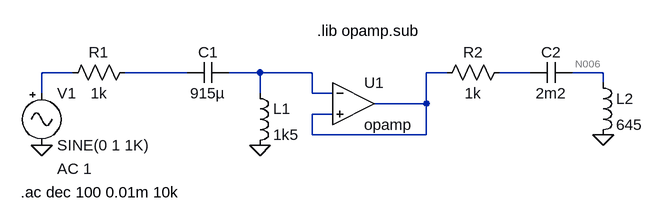
[diagram p0: schematic Draft1.asc]
Draft1.asc, the LTspice schematic file:
Version 4
SHEET 1 996 680
WIRE -80 128 -128 128
WIRE 96 128 0 128
WIRE 208 128 160 128
WIRE 288 128 208 128
WIRE 496 128 464 128
WIRE 624 128 576 128
WIRE 736 128 688 128
WIRE 736 144 736 128
WIRE -128 160 -128 128
WIRE 208 160 208 128
WIRE 288 160 288 128
WIRE 320 160 288 160
WIRE 464 176 464 128
WIRE 464 176 384 176
WIRE 320 192 288 192
WIRE 288 224 288 192
WIRE 464 224 464 176
WIRE 464 224 288 224
FLAG 208 240 0
FLAG 736 224 0
FLAG -128 240 0
SYMBOL res 16 112 R90
WINDOW 0 0 56 VBottom 2
WINDOW 3 32 56 VTop 2
SYMATTR InstName R1
SYMATTR Value 1k
SYMBOL res 592 112 R90
WINDOW 0 0 56 VBottom 2
WINDOW 3 32 56 VTop 2
SYMATTR InstName R2
SYMATTR Value 1k
SYMBOL cap 160 112 R90
WINDOW 0 0 32 VBottom 2
WINDOW 3 32 32 VTop 2
SYMATTR InstName C1
SYMATTR Value 915µ
SYMBOL ind 192 144 R0
SYMATTR InstName L1
SYMATTR Value 1k5
SYMBOL OpAmps\\opamp 352 112 R0
SYMATTR InstName U1
SYMBOL cap 688 112 R90
WINDOW 0 0 32 VBottom 2
WINDOW 3 32 32 VTop 2
SYMATTR InstName C2
SYMATTR Value 2m2
SYMBOL ind 720 128 R0
SYMATTR InstName L2
SYMATTR Value 645
SYMBOL Misc\\signal -128 144 R0
WINDOW 123 24 132 Left 2
WINDOW 39 0 0 Left 0
SYMATTR InstName V1
SYMATTR Value2 AC 1
TEXT 296 64 Left 2 !.lib opamp.sub
TEXT -160 312 Left 2 !.ac dec 100 0.01m 10k

The netlist it stands for:
* Draft1.asc
R1 N002 N001 1k
R2 N005 N004 1k
C1 N003 N002 915µ
L1 N003 0 1k5
XU1 N003 N004 N004 opamp Aol=100K GBW=10Meg  ; pins invin noninvin out
C2 N006 N005 2m2
L2 N006 0 645
V1 N001 0 SINE(0 1 1K) AC 1
.lib opamp.sub
.ac dec 100 0.01m 10k
.backanno
.end

* Results of the author's LTspice run, read from the files saved beside the schematic
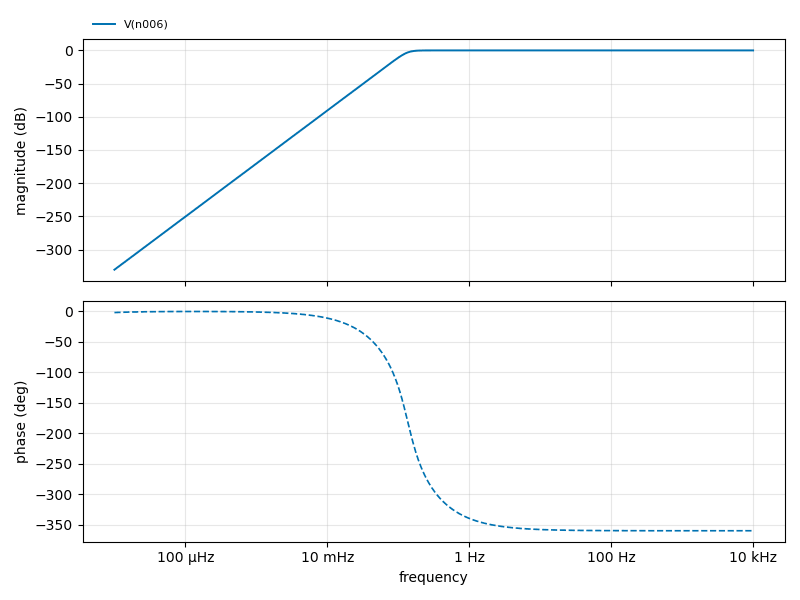
[diagram p1: AC Analysis of Draft1.asc, plotted from the saved traces]
* AC Analysis, 1 run:
*   V(n006): -330.35 dB at 10 µHz, 0.00 dB at 10 kHz, peak 0.01 dB at 363.1 mHz, 3 dB below the peak at 136.2 mHz